# Altium schematic sheet LPCB219 - OVERVIEW.SchDoc
size A3; Address1: Factory 10; Address2: 9-13 Dingley Avenue, Dandeong, VICTORIA 3175, AUSTRALIA; DocumentNumber: 1; Revision: 1; SheetNumber: 1; SheetTotal: 7; Lockie__PCB_SUB_ASSEMBLY: Overview; Lockie__PCB_ASSEMBLY: Main; Lockie__LDL: LPCB219; Lockie__PCB_DESCRIPTION: Control Node
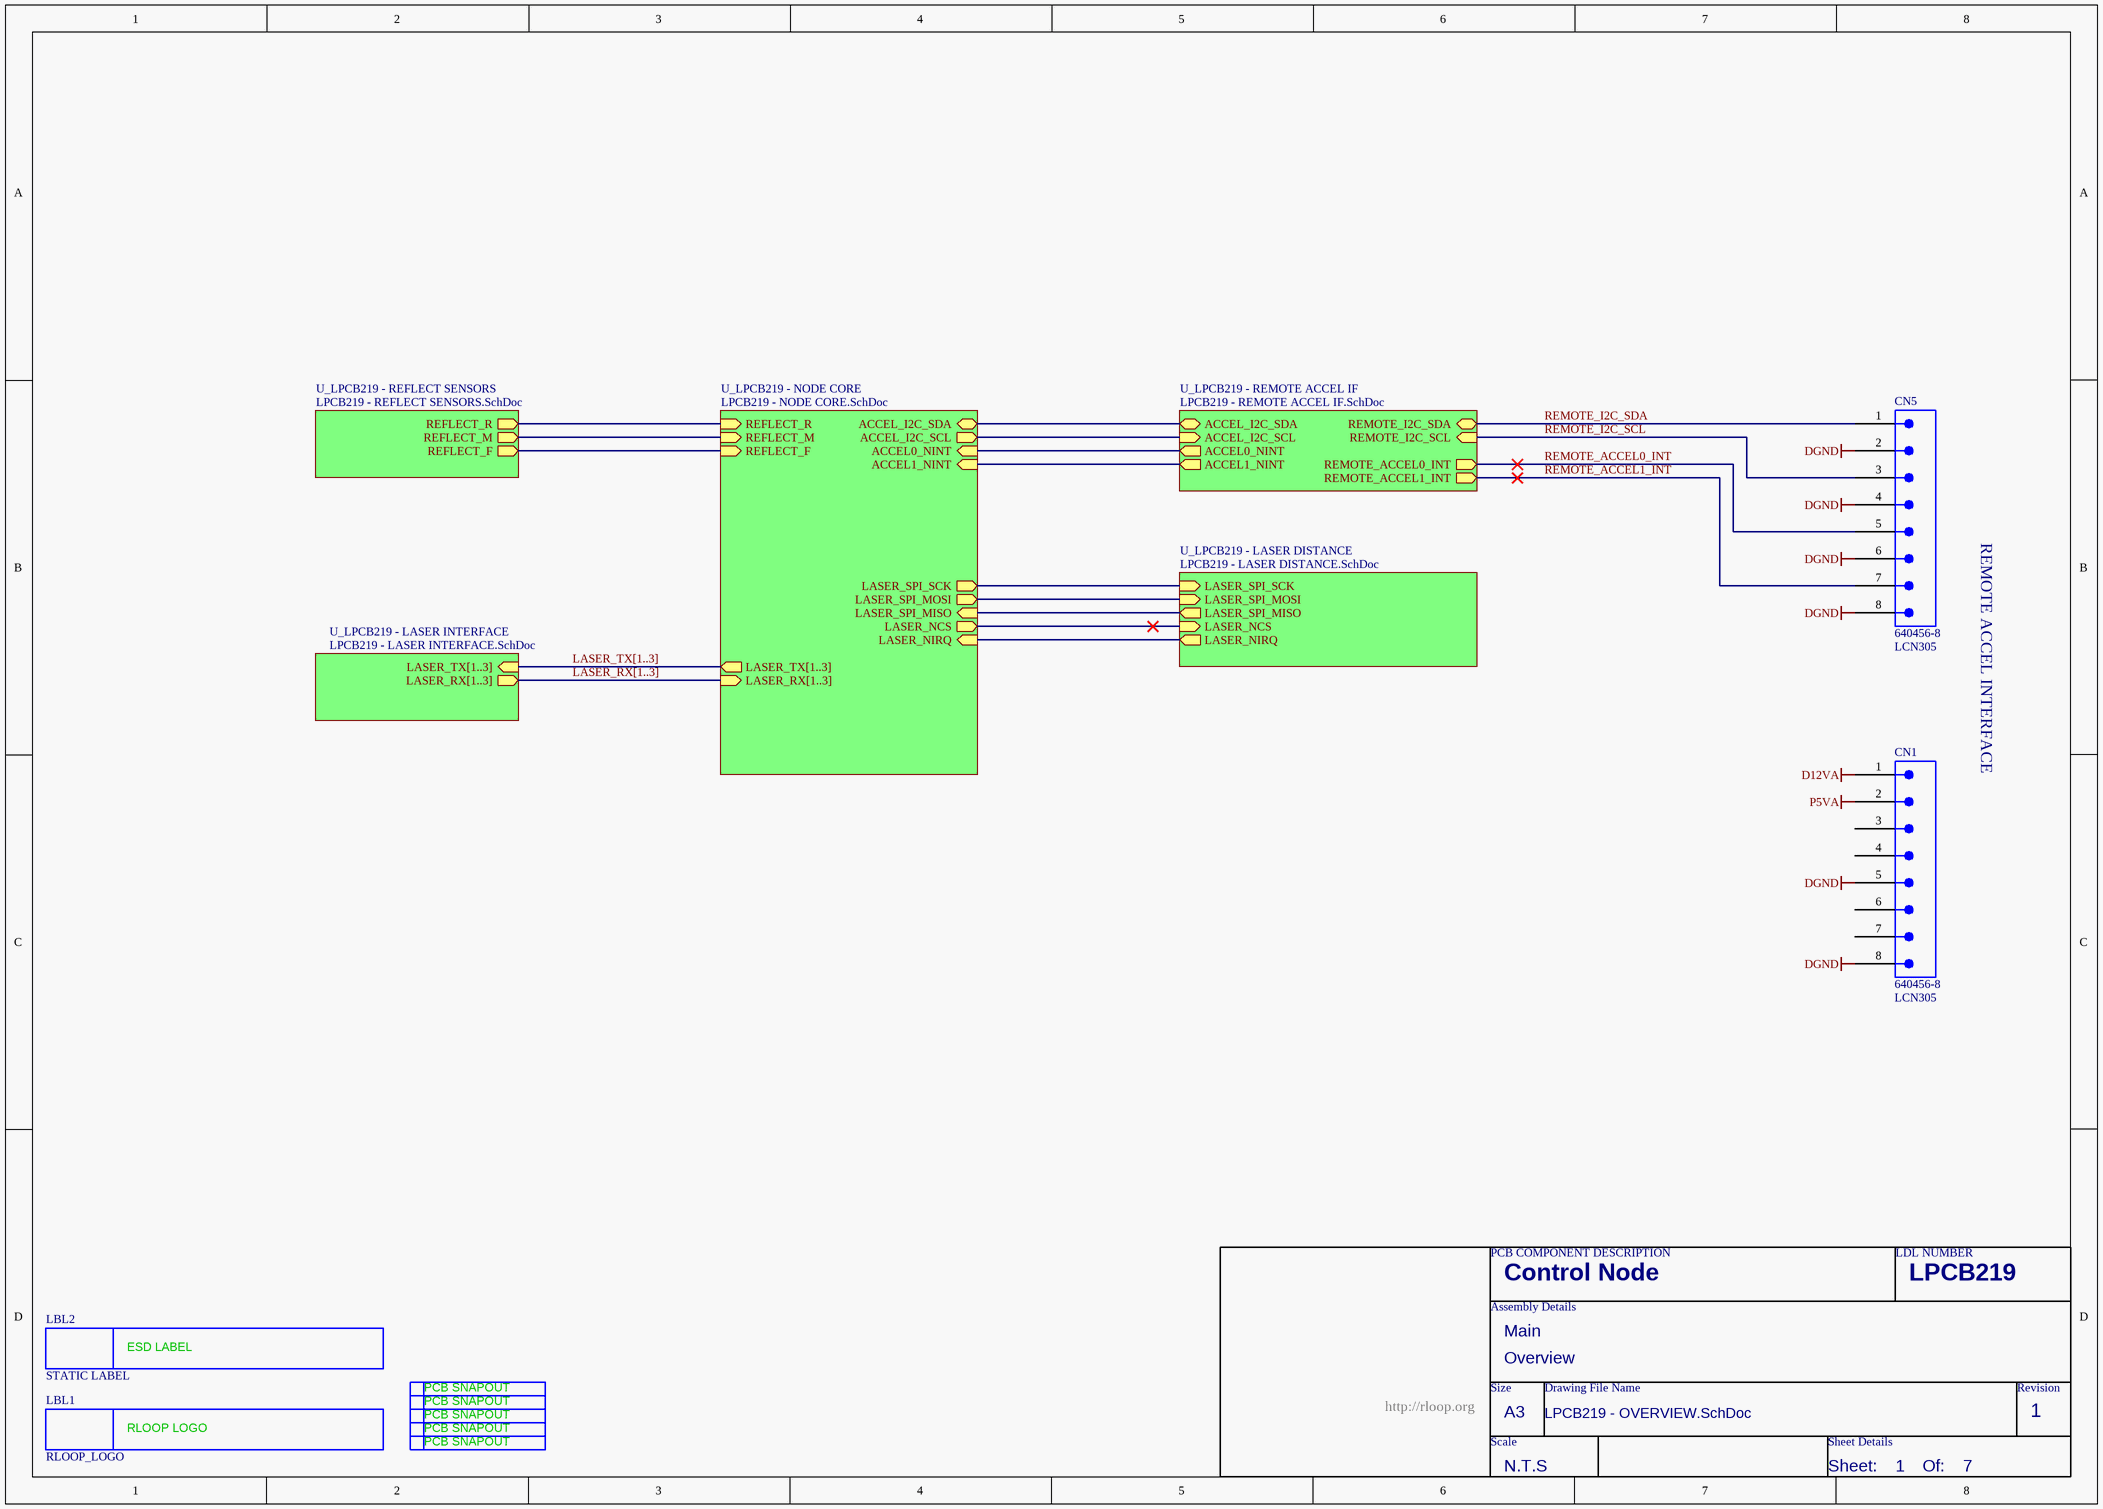
[diagram p0: LPCB219 - OVERVIEW.SchDoc]

## Parts
CN1  640456-8  LDL_NUMBER: LCN305  [640456-8]
CN5  640456-8  LDL_NUMBER: LCN305  [640456-8]
LBL1  RLOOP_LOGO  [RLOOP_LOGO]  (no BOM)
LBL2  STATIC LABEL  [STATIC_LABEL]  (no BOM)
SN2  PCB_SNAPOUT  [SNAPOUT_NEW]  (value not drawn)  (no BOM)
SN3  PCB_SNAPOUT  [SNAPOUT_NEW]  (value not drawn)  (no BOM)
SN4  PCB_SNAPOUT  [SNAPOUT_NEW]  (value not drawn)  (no BOM)
SN5  PCB_SNAPOUT  [SNAPOUT_NEW]  (value not drawn)  (no BOM)
SN6  PCB_SNAPOUT  [SNAPOUT_NEW]  (value not drawn)  (no BOM)

## Sub-sheets
U_LPCB219 - LASER DISTANCE = LPCB219 - LASER DISTANCE.SchDoc: LASER_NIRQ (out), LASER_NCS (in), LASER_SPI_SCK (in), LASER_SPI_MOSI (in), LASER_SPI_MISO (out)
U_LPCB219 - LASER INTERFACE = LPCB219 - LASER INTERFACE.SchDoc: LASER_TX[1..3] (in), LASER_RX[1..3] (out)
U_LPCB219 - NODE CORE = LPCB219 - NODE CORE.SchDoc: ACCEL_I2C_SDA (bidir), ACCEL_I2C_SCL (out), LASER_SPI_MOSI (out), LASER_SPI_MISO (in), LASER_SPI_SCK (out), ACCEL0_NINT (in), ACCEL1_NINT (in), REFLECT_R (in), LASER_NCS (out), LASER_NIRQ (in), REFLECT_M (in), REFLECT_F (in), LASER_TX[1..3] (out), LASER_RX[1..3] (in)
U_LPCB219 - REFLECT SENSORS = LPCB219 - REFLECT SENSORS.SchDoc: REFLECT_R (out), REFLECT_M (out), REFLECT_F (out)
U_LPCB219 - REMOTE ACCEL IF = LPCB219 - REMOTE ACCEL IF.SchDoc: REMOTE_I2C_SDA (bidir), REMOTE_I2C_SCL (in), ACCEL_I2C_SCL (in), ACCEL_I2C_SDA (bidir), ACCEL0_NINT (out), ACCEL1_NINT (out), REMOTE_ACCEL0_INT (out), REMOTE_ACCEL1_INT (out)

## Nets
D12VA: CN1.1
DGND: CN1.5 CN1.8 CN5.2 CN5.4 CN5.6 CN5.8
P5VA: CN1.2
REMOTE_ACCEL0_INT: CN5.5 ; sheet U_LPCB219 - REMOTE ACCEL IF/REMOTE_ACCEL0_INT
REMOTE_ACCEL1_INT: CN5.7 ; sheet U_LPCB219 - REMOTE ACCEL IF/REMOTE_ACCEL1_INT
REMOTE_I2C_SCL: CN5.3 ; sheet U_LPCB219 - REMOTE ACCEL IF/REMOTE_I2C_SCL
REMOTE_I2C_SDA: CN5.1 ; sheet U_LPCB219 - REMOTE ACCEL IF/REMOTE_I2C_SDA
(unnamed): sheet U_LPCB219 - REFLECT SENSORS/REFLECT_R, sheet U_LPCB219 - NODE CORE/REFLECT_R
(unnamed): sheet U_LPCB219 - REFLECT SENSORS/REFLECT_M, sheet U_LPCB219 - NODE CORE/REFLECT_M
(unnamed): sheet U_LPCB219 - REFLECT SENSORS/REFLECT_F, sheet U_LPCB219 - NODE CORE/REFLECT_F
(unnamed): sheet U_LPCB219 - LASER DISTANCE/LASER_NIRQ, sheet U_LPCB219 - NODE CORE/LASER_NIRQ
(unnamed): sheet U_LPCB219 - LASER DISTANCE/LASER_NCS, sheet U_LPCB219 - NODE CORE/LASER_NCS
(unnamed): sheet U_LPCB219 - LASER DISTANCE/LASER_SPI_SCK, sheet U_LPCB219 - NODE CORE/LASER_SPI_SCK
(unnamed): sheet U_LPCB219 - LASER DISTANCE/LASER_SPI_MOSI, sheet U_LPCB219 - NODE CORE/LASER_SPI_MOSI
(unnamed): sheet U_LPCB219 - LASER DISTANCE/LASER_SPI_MISO, sheet U_LPCB219 - NODE CORE/LASER_SPI_MISO
(unnamed): sheet U_LPCB219 - NODE CORE/ACCEL_I2C_SDA, sheet U_LPCB219 - REMOTE ACCEL IF/ACCEL_I2C_SDA
(unnamed): sheet U_LPCB219 - NODE CORE/ACCEL_I2C_SCL, sheet U_LPCB219 - REMOTE ACCEL IF/ACCEL_I2C_SCL
(unnamed): sheet U_LPCB219 - NODE CORE/ACCEL0_NINT, sheet U_LPCB219 - REMOTE ACCEL IF/ACCEL0_NINT
(unnamed): sheet U_LPCB219 - NODE CORE/ACCEL1_NINT, sheet U_LPCB219 - REMOTE ACCEL IF/ACCEL1_NINT

Not connected (* = marked no-connect by the designer): CN1 3 4 6 7

## Buses and harness runs
bus LASER_RX[1..3] = sheet U_LPCB219 - LASER INTERFACE/LASER_RX[1..3] = sheet U_LPCB219 - NODE CORE/LASER_RX[1..3]
bus LASER_TX[1..3] = sheet U_LPCB219 - LASER INTERFACE/LASER_TX[1..3] = sheet U_LPCB219 - NODE CORE/LASER_TX[1..3]

## Notes on the sheet
- REMOTE ACCEL INTERFACE
- PCB COMPONENT DESCRIPTION
- LDL NUMBER
- Assembly Details
- Size
- Drawing File Name
- Revision
- http://rloop.org
- Scale
- A3
- Sheet Details
- N.T.S
- Sheet:
- Of:
- (in symbol PCB_SNAPOUT) PCB SNAPOUT
- (in symbol RLOOP_LOGO) RLOOP LOGO
- (in symbol STATIC LABEL) ESD LABEL

## Library data of the parts
CN1 CN5 = 640456-8: Connector, Male Header, 8 Way; FMEDA__CHANNEL: COM; FMEDA__OPERATING__CURRENT_MAX: 0; FMEDA__OPERATING__TEMP_MAX: 50; FMEDA__OPERATING__TEMP_MIN: -20; FMEDA__OPERATING__TEMP_TYP: 27; FMEDA__OPERATING__VOLTAGE_MAX: 16; FMEDA__OPERATING__VOLTAGE_TYP: 12; FMEDA__FUNCTION_IN_SYSTEM: *; FMEDA__OPERATING__CURRENT_MIN: 0; FMEDA__OPERATING__CURRENT_TYP: 0; FMEDA__OPERATING__VOLTAGE_MIN: 0
LBL1 = RLOOP_LOGO: FMEDA__CHANNEL: DIAG; FMEDA__FUNCTION_IN_SYSTEM: *
LBL2 = STATIC LABEL: FMEDA__CHANNEL: DIAG; FMEDA__FUNCTION_IN_SYSTEM: *
SN2-SN6 = PCB_SNAPOUT: FMEDA__CHANNEL: DIAG; FMEDA__FUNCTION_IN_SYSTEM: *